# Altium schematic sheet MCU.SchDoc
size A4
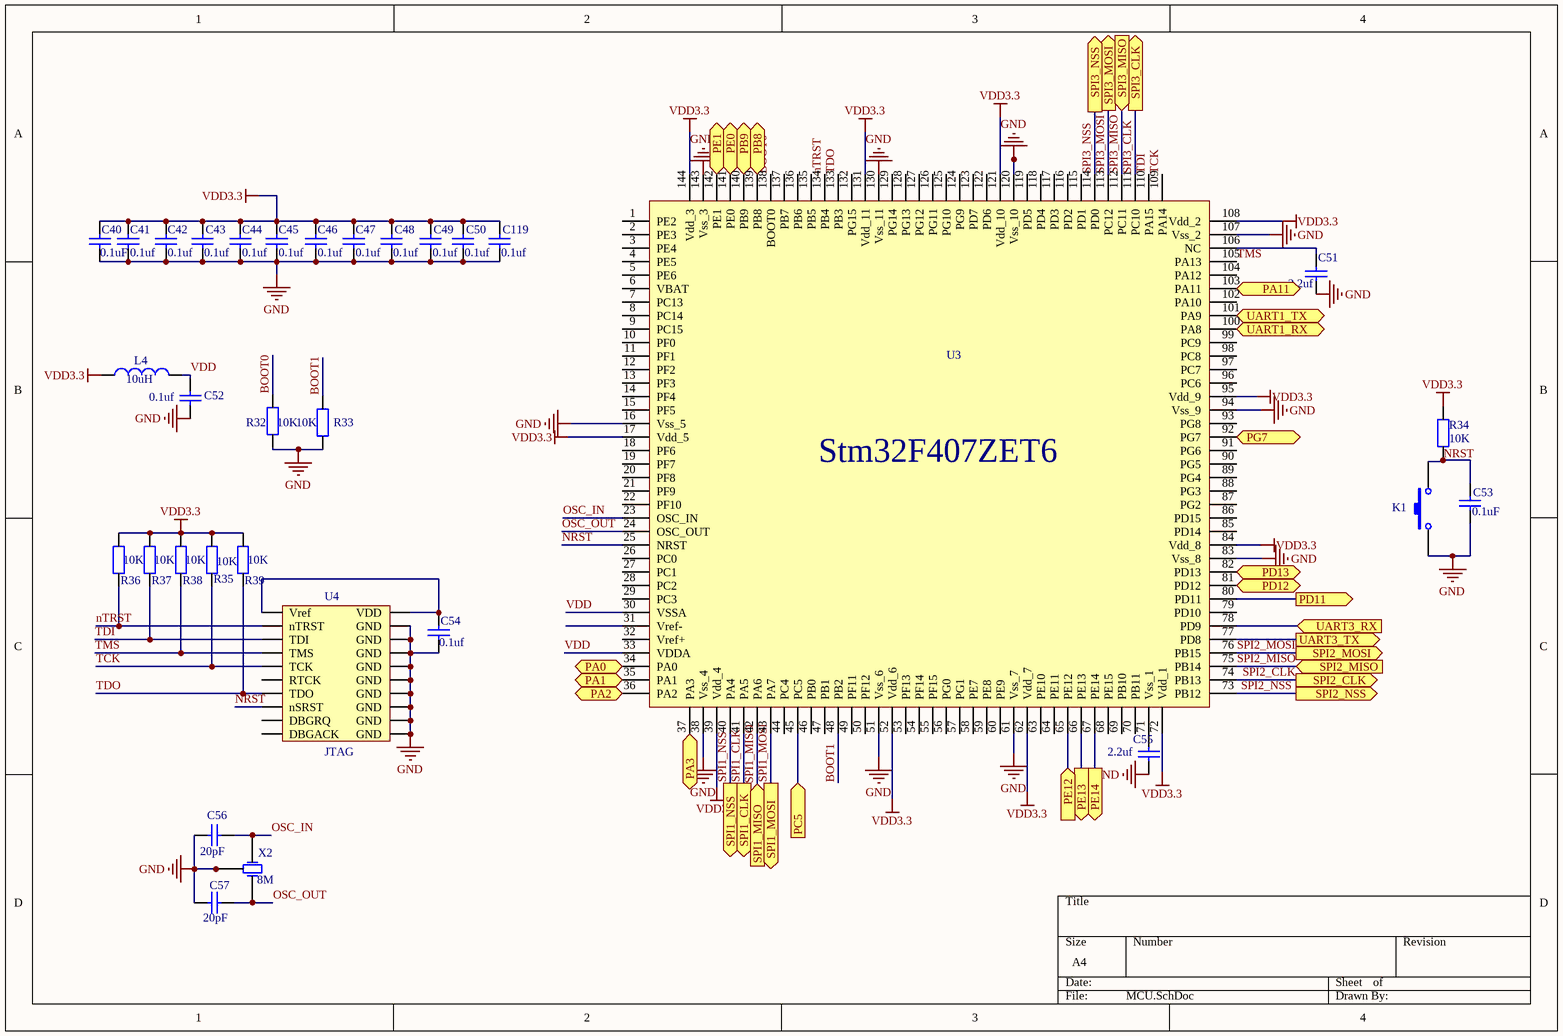
[diagram p0: MCU.SchDoc]

## Parts
C40  value 0.1uF  [0603]  (hidden comment: Capacitor-0805)
C41  value 0.1uf  [0603]  (hidden comment: Capacitor-0805)
C42  value 0.1uf  [0603]  (hidden comment: Capacitor-0805)
C43  value 0.1uf  [0603]  (hidden comment: Capacitor-0805)
C44  value 0.1uf  [0603]  (hidden comment: Capacitor-0805)
C45  value 0.1uf  [0603]  (hidden comment: Capacitor-0805)
C46  value 0.1uf  [0603]  (hidden comment: Capacitor-0805)
C47  value 0.1uf  [0603]  (hidden comment: Capacitor-0805)
C48  value 0.1uf  [0603]  (hidden comment: Capacitor-0805)
C49  value 0.1uf  [0603]  (hidden comment: Capacitor-0805)
C50  value 0.1uf  [0603]  (hidden comment: Capacitor-0805)
C51  value 2.2uf  [0603]  (hidden comment: Capacitor-0603)
C52  value 0.1uf  [0603]  (hidden comment: Capacitor-0805)
C53  value 0.1uF  [0603]  (hidden comment: Capacitor-0805)
C54  value 0.1uf  [0603]  (hidden comment: Capacitor-0805)
C55  value 2.2uf  [0603]  (hidden comment: Capacitor-0603)
C56  value 20pF  [0603]  (hidden comment: Capacitor-0805)
C57  value 20pF  [0603]  (hidden comment: Capacitor-0805)
C119  value 0.1uf  [0603]  (hidden comment: Capacitor-0805)
K1  按键  [贴片按键]  (value not drawn)
L4  value 10uH  [0805]  (hidden comment: Inductor)
R32  value 10K  [0603]  (hidden comment: Resistor-0805)
R33  value 10K  [0603]  (hidden comment: Resistor-0805)
R34  value 10K  [0603]  (hidden comment: Resistor-0805)
R35  value 10K  [0603]  (hidden comment: Resistor-0805)
R36  value 10K  [0603]  (hidden comment: Resistor-0805)
R37  value 10K  [0603]  (hidden comment: Resistor-0805)
R38  value 10K  [0603]  (hidden comment: Resistor-0805)
R39  value 10K  [0603]  (hidden comment: Resistor-0805)
U3  STM32F407ZET6  [Stm32f407ZET6 - duplicate]  (value not drawn)
U4  JTAG  [JTAG-20]
X2  value 8M  [3225无源晶振]  (hidden comment: 3225无源晶振)

## Ports
PA0 (in), PA1 (out), PA2 (out), PA3 (out), PA11 (out), PB8 (out), PB9 (out), PC5 (in), PD11 (out), PD12, PD13, PE0 (out), PE1 (out), PE12 (in), PE13 (out), PE14 (out), PG7 (out), SPI1_CLK (out), SPI1_MISO (in), SPI1_MOSI (out), SPI1_NSS (out), SPI2_CLK (out), SPI2_MISO (in), SPI2_MOSI (out), SPI2_NSS (out), SPI3_CLK (out), SPI3_MISO (in), SPI3_MOSI (out), SPI3_NSS (out), UART1_RX (in), UART1_TX (out), UART3_RX (in), UART3_TX (out)

## Nets
GND: C40.1 C41.1 C42.1 C43.1 C44.1 C45.1 C46.1 C47.1 C48.1 C49.1 C50.1 C51.1 C52.1 C53.1 C54.1 C55.1 C56.1 C57.1 C119.1 K1.1 R32.1 R33.1 U3.16(Vss_5) U3.38(Vss_4) U3.51(Vss_6) U3.61(Vss_7) U3.83(Vss_8) U3.94(Vss_9) U3.107(Vss_2) U3.120(Vss_10) U3.130(Vss_11) U3.143(Vss_3) U4.4(GND) U4.6(GND) U4.8(GND) U4.10(GND) U4.12(GND) U4.14(GND) U4.16(GND) U4.18(GND) U4.20(GND) X2.2(GND) X2.4(GND)
VDD3.3: C40.2 C41.2 C42.2 C43.2 C44.2 C45.2 C46.2 C47.2 C48.2 C49.2 C50.2 C119.2 L4.1 R34.2 R35.2 R36.2 R37.2 R38.2 R39.2 U3.17(Vdd_5) U3.39(Vdd_4) U3.52(Vdd_6) U3.62(Vdd_7) U3.72(Vdd_1) U3.84(Vdd_8) U3.95(Vdd_9) U3.108(Vdd_2) U3.121(Vdd_10) U3.131(Vdd_11) U3.144(Vdd_3)
BOOT0: R32.2 U3.138(BOOT0)
BOOT1: R33.2 U3.48(PB2)
NRST: C53.2 K1.2 R34.1 U3.25(NRST) U4.15(nSRST)
nTRST: R36.1 U3.134(PB4) U4.3(nTRST)
OSC_IN: C56.2 U3.23(OSC_IN) X2.1(OSC1)
OSC_OUT: C57.2 U3.24(OSC_OUT) X2.3(OSC2)
PA0: U3.34(PA0) ; port PA0
PA1: U3.35(PA1) ; port PA1
PA2: U3.36(PA2) ; port PA2
PA3: U3.37(PA3) ; port PA3
PA11: U3.103(PA11) ; port PA11
PB8: U3.139(PB8) ; port PB8
PB9: U3.140(PB9) ; port PB9
PC5: U3.45(PC5) ; port PC5
PD11: U3.80(PD11) ; port PD11
PD12: U3.81(PD12) ; port PD12
PD13: U3.82(PD13) ; port PD13
PE0: U3.141(PE0) ; port PE0
PE1: U3.142(PE1) ; port PE1
PE12: U3.65(PE12) ; port PE12
PE13: U3.66(PE13) ; port PE13
PE14: U3.67(PE14) ; port PE14
PG7: U3.92(PG7) ; port PG7
SPI1_CLK: U3.41(PA5) ; port SPI1_CLK
SPI1_MISO: U3.42(PA6) ; port SPI1_MISO
SPI1_MOSI: U3.43(PA7) ; port SPI1_MOSI
SPI1_NSS: U3.40(PA4) ; port SPI1_NSS
SPI2_CLK: U3.74(PB13) ; port SPI2_CLK
SPI2_MISO: U3.75(PB14) ; port SPI2_MISO
SPI2_MOSI: U3.76(PB15) ; port SPI2_MOSI
SPI2_NSS: U3.73(PB12) ; port SPI2_NSS
SPI3_CLK: U3.111(PC10) ; port SPI3_CLK
SPI3_MISO: U3.112(PC11) ; port SPI3_MISO
SPI3_MOSI: U3.113(PC12) ; port SPI3_MOSI
SPI3_NSS: U3.114(PD0) ; port SPI3_NSS
TCK: R35.1 U3.109(PA14) U4.9(TCK)
TDI: R37.1 U3.110(PA15) U4.5(TDI)
TDO: R39.1 U3.133(PB3) U4.13(TDO)
TMS: R38.1 U3.105(PA13) U4.7(TMS)
UART1_RX: U3.100(PA8) ; port UART1_RX
UART1_TX: U3.101(PA9) ; port UART1_TX
UART3_RX: U3.78(PD9) ; port UART3_RX
UART3_TX: U3.77(PD8) ; port UART3_TX
VDD: C52.2 L4.2 U3.30(VSSA) U3.33(VDDA)
NetC51_2: C51.2 U3.106(NC)
NetC54_2: C54.2 U4.1(Vref) U4.2(VDD)
NetC55_2: C55.2 U3.71(Vss_1)

Not connected (* = marked no-connect by the designer): U3 1(PE2) 2(PE3) 3(PE4) 4(PE5) 5(PE6) 6(VBAT) 7(PC13) 8(PC14) 9(PC15) 10(PF0) 11(PF1) 12(PF2) 13(PF3) 14(PF4) 15(PF5) 18(PF6) 19(PF7) 20(PF8) 21(PF9) 22(PF10) 26(PC0) 27(PC1) 28(PC2) 29(PC3) 31(Vref-) 32(Vref+) 44(PC4) 46(PB0) 47(PB1) 49(PF11) 50(PF12) 53(PF13) 54(PF14) 55(PF15) 56(PG0) 57(PG1) 58(PE7) 59(PE8) 60(PE9) 63(PE10) 64(PE11) 68(PE15) 69(PB10) 70(PB11) 79(PD10) 85(PD14) 86(PD15) 87(PG2) 88(PG3) 89(PG4) 90(PG5) 91(PG6) 93(PG8) 96(PC6) 97(PC7) 98(PC8) 99(PC9) 102(PA10) 104(PA12) 115(PD1) 116(PD2) 117(PD3) 118(PD4) 119(PD5) 122(PD6) 123(PD7) 124(PG9) 125(PG10) 126(PG11) 127(PG12) 128(PG13) 129(PG14) 132(PG15) 135(PB5) 136(PB6) 137(PB7); U4 11(RTCK) 17(DBGRQ) 19(DBGACK)

## Notes on the sheet
- (in symbol STM32F407Z) Stm32F407ZET6

## Library data of the parts
C40-C50 C52 C54 C119 = Capacitor
C53 C56 C57 = Capacitor-0
L4 = Ind
R32 R33 = Resistor
R34-R39 = Resistor-0
U3 = STM32F407Z: Value: STM32F407ZET6
U4 = J: Value: JTAG